# Altium schematic sheet x-IMU3-SA-TRRS.SchDoc
size A4; SheetNumber: 1; SheetTotal: 1
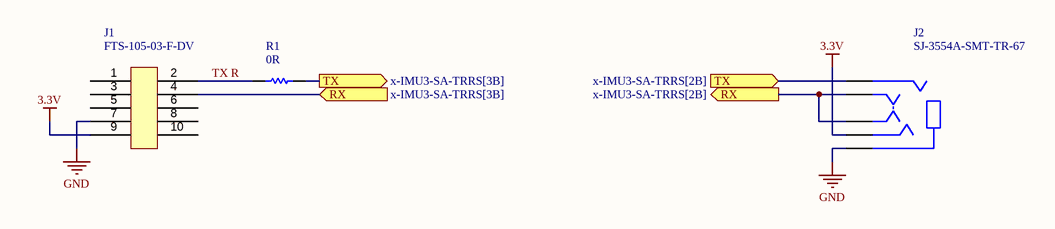
[diagram p0: x-IMU3-SA-TRRS.SchDoc]

## Parts
J1  FTS-105-03-F-DV  [FTS-105-03-F-DV]
J2  SJ-3554A-SMT-TR-67  [SJ-3554A-SMT-TR-67]
R1  0R  [Resistor 0603]

## Ports
RX (in, see x-IMU3-SA-TRRS[3B]), RX (out, see x-IMU3-SA-TRRS[2B]), TX (in, see x-IMU3-SA-TRRS[2B]), TX (out, see x-IMU3-SA-TRRS[3B])

## Nets
3.3V: J1.9 J2.3(ring_1)
GND: J1.7 J2.1(sleeve)
RX: J1.4 J2.2(tip) J2.5(tip) ; port RX
TX: J2.4(ring_2) R1.2 ; port TX
TX R: J1.2 R1.1

Not connected (* = marked no-connect by the designer): J1 1(*) 3(*) 5(*) 6(*) 8(*) 10(*)

## Notes on the sheet
- TITLE
- SIZE
- A4
- VARIANT
- PROJECT
- SHEET
- VERSION
- OF
- AUTHOR
- DATE

## Library data of the parts
R1 = Resistor